# Altium project STM32 design number 2.PrjPcb
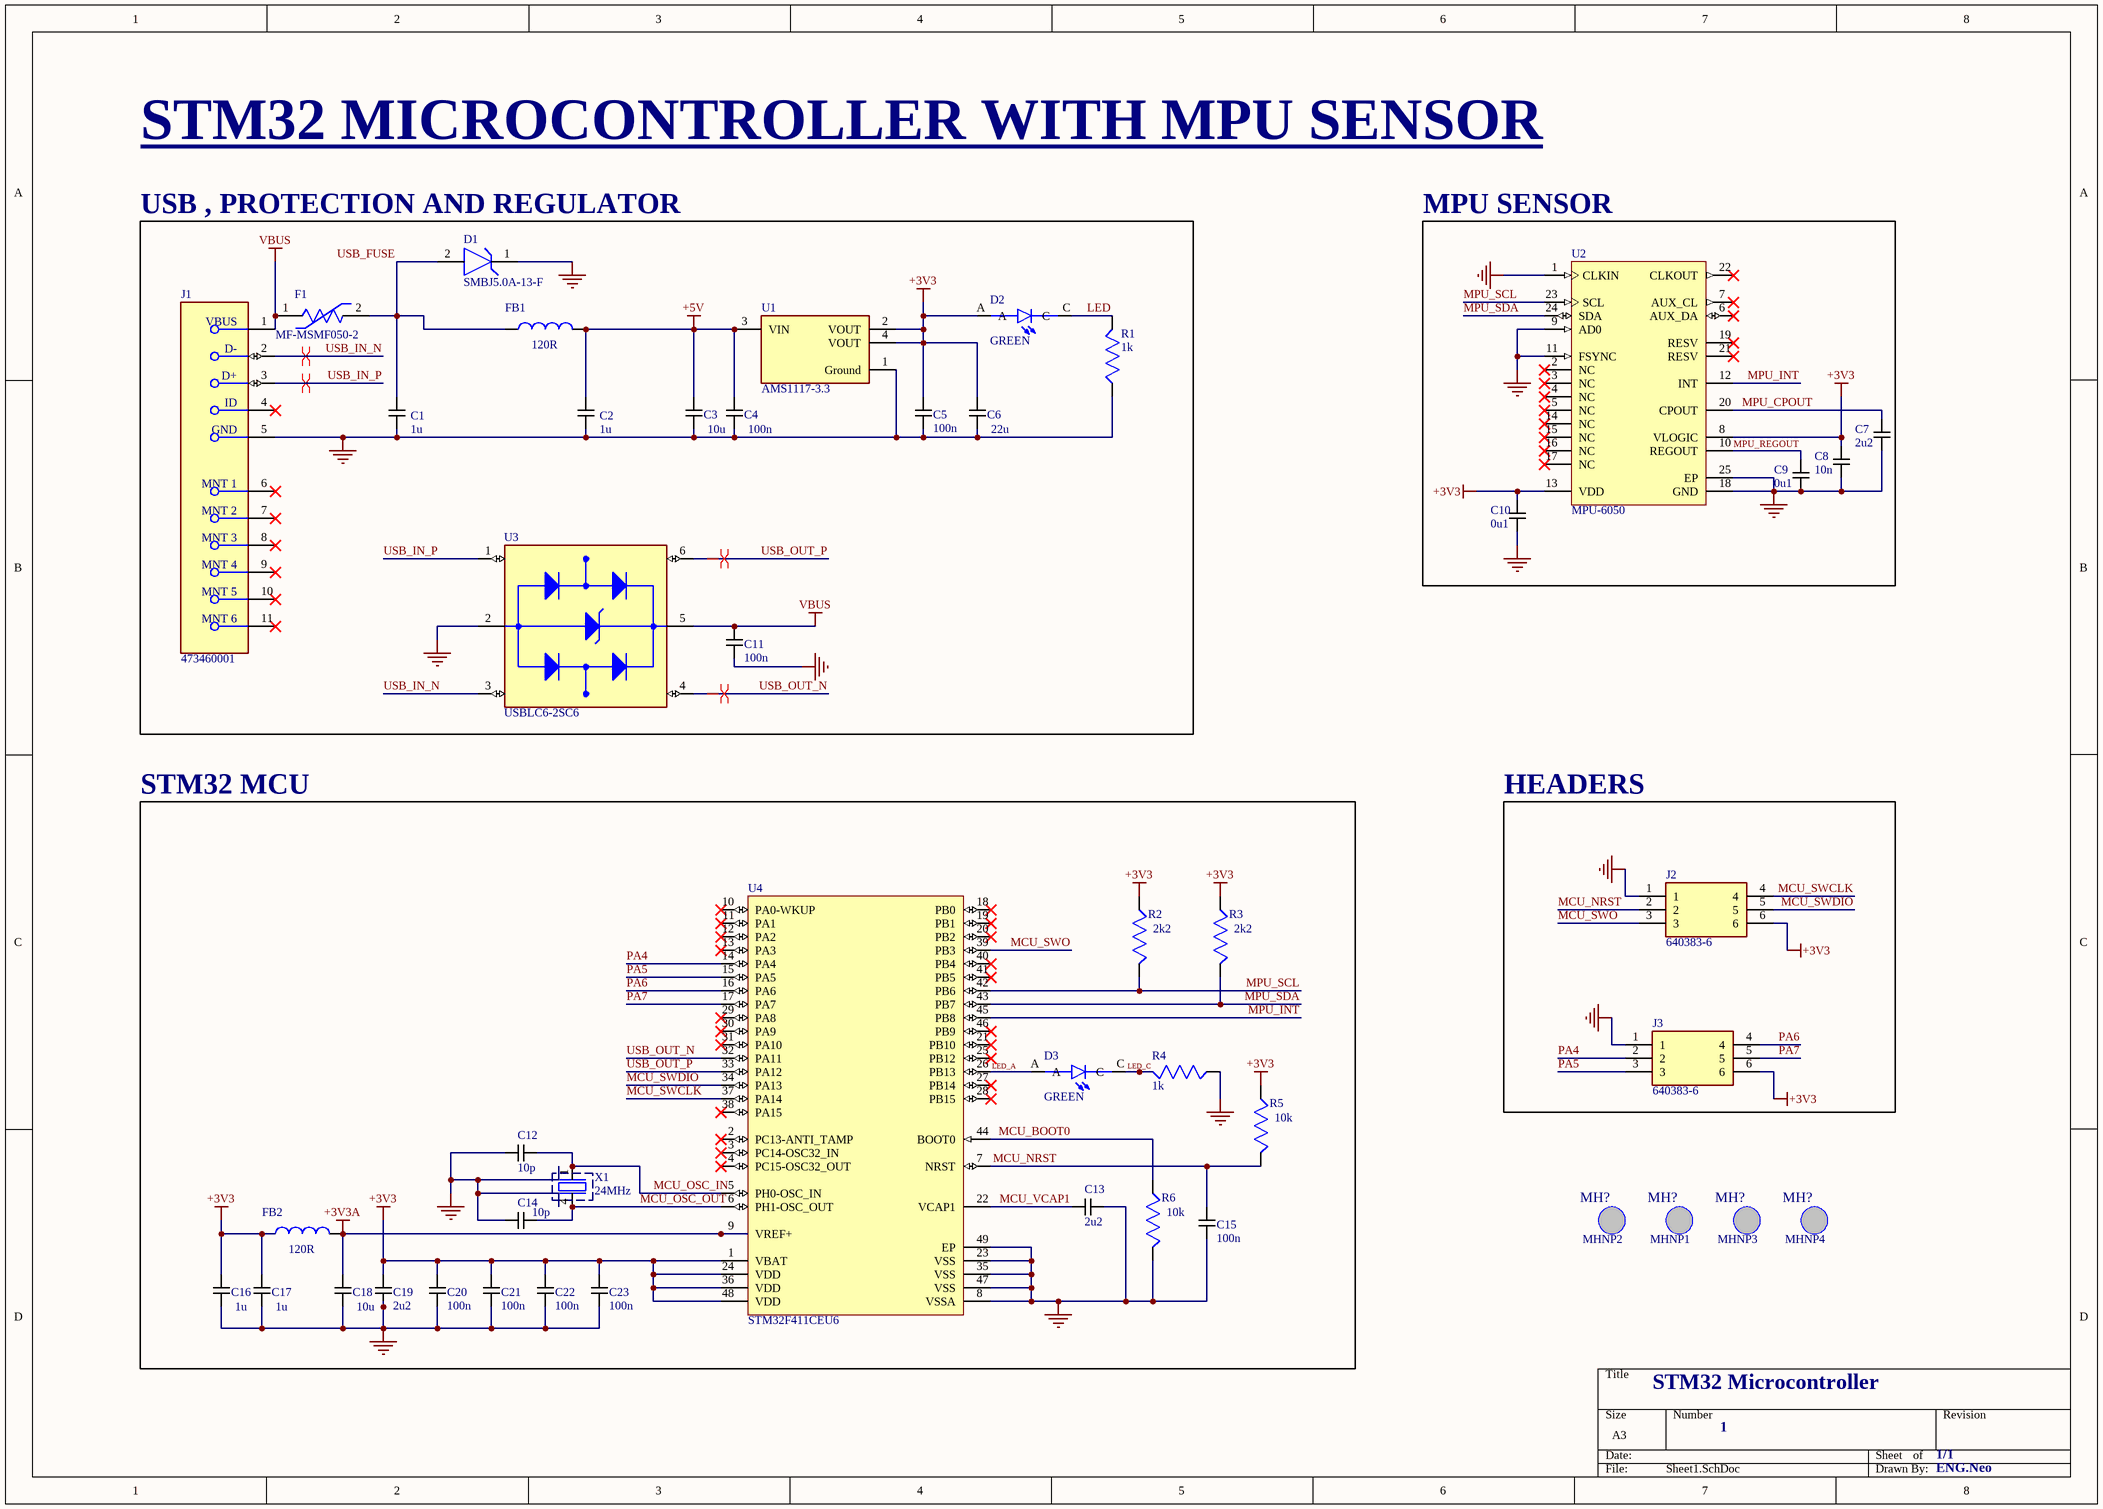
[diagram p0: Sheet1.SchDoc]
Categotry: MID; Date: Sep 21 2026; Designer: ENG.Neo; Design number: Two; Title: STM32 Microcontroller
1 sheet, 47 parts. Net scope: global (net labels, ports and power ports of the same name join across sheets).
Board file: PCB1.PcbDoc

## Sheet Sheet1.SchDoc: STM32 Microcontroller
size A3; SheetNumber: 1; SheetTotal: 1

### Parts
C1  Capacitance: 1u  [CAPCP2012X09N]  (hidden comment: 100nF Ceramic Multilayer Capacitor_1)
C2  Capacitance: 1u  [CAPCP2012X09N]  (hidden comment: 100nF Ceramic Multilayer Capacitor_1)
C3  Capacitance: 10u  [CAPCP2012X09N]  (hidden comment: 100nF Ceramic Multilayer Capacitor_1)
C4  Capacitance: 100n  [CAPCP2012X09N]  (hidden comment: 100nF Ceramic Multilayer Capacitor_1)
C5  Capacitance: 100n  [CAPCP2012X09N]  (hidden comment: 100nF Ceramic Multilayer Capacitor_1)
C6  Capacitance: 22u  [CAPCP2012X09N]  (hidden comment: 100nF Ceramic Multilayer Capacitor_1)
C7  Capacitance: 2u2  [CAPCP2012X09N]  (hidden comment: 100nF Ceramic Multilayer Capacitor_1)
C8  Capacitance: 10n  [CAPCP2012X09N]  (hidden comment: 100nF Ceramic Multilayer Capacitor_1)
C9  Capacitance: 0u1  [CAPCP2012X09N]  (hidden comment: 100nF Ceramic Multilayer Capacitor_1)
C10  Capacitance: 0u1  [CAPCP2012X09N]  (hidden comment: 100nF Ceramic Multilayer Capacitor_1)
C11  Capacitance: 100n  [CAPCP2012X09N]  (hidden comment: 100nF Ceramic Multilayer Capacitor_1)
C12  Capacitance: 10p  [CAPCP2012X09N]  (hidden comment: 100nF Ceramic Multilayer Capacitor_1)
C13  Capacitance: 2u2  [CAPCP2012X09N]  (hidden comment: 100nF Ceramic Multilayer Capacitor_1)
C14  Capacitance: 10p  [CAPCP2012X09N]  (hidden comment: 100nF Ceramic Multilayer Capacitor_1)
C15  Capacitance: 100n  [CAPCP2012X09N]  (hidden comment: 100nF Ceramic Multilayer Capacitor_1)
C16  Capacitance: 1u  [CAPCP2012X09N]  (hidden comment: 100nF Ceramic Multilayer Capacitor_1)
C17  Capacitance: 1u  [CAPCP2012X09N]  (hidden comment: 100nF Ceramic Multilayer Capacitor_1)
C18  Capacitance: 10u  [CAPCP2012X09N]  (hidden comment: 100nF Ceramic Multilayer Capacitor_1)
C19  Capacitance: 2u2  [CAPCP2012X09N]  (hidden comment: 100nF Ceramic Multilayer Capacitor_1)
C20  Capacitance: 100n  [CAPCP2012X09N]  (hidden comment: 100nF Ceramic Multilayer Capacitor_1)
C21  Capacitance: 100n  [CAPCP2012X09N]  (hidden comment: 100nF Ceramic Multilayer Capacitor_1)
C22  Capacitance: 100n  [CAPCP2012X09N]  (hidden comment: 100nF Ceramic Multilayer Capacitor_1)
C23  Capacitance: 100n  [CAPCP2012X09N]  (hidden comment: 100nF Ceramic Multilayer Capacitor_1)
D1  SMBJ5.0A-13-F  [FP-SMB-MFG]
D2  GREEN  [LEDC2012X70N]
D3  GREEN  [LEDC2012X70N]
F1  MF-MSMF050-2  [FP-MF-MSMF050-2-MFG]
FB1  120R  [WE-CBF HF_0603_HC]
FB2  120R  [WE-CBF HF_0603_HC]
J1  473460001  [FP-473460001-MFG]
J2  640383-6  [TE_640383-6]
J3  640383-6  [TE_640383-6]
MHNP1  Mounting hole non plated 3.2mm  [MHNP3P2MM]  (value not drawn)
MHNP2  Mounting hole non plated 3.2mm  [MHNP3P2MM]  (value not drawn)
MHNP3  Mounting hole non plated 3.2mm  [MHNP3P2MM]  (value not drawn)
MHNP4  Mounting hole non plated 3.2mm  [MHNP3P2MM]  (value not drawn)
R1  1k  [RESC2012X60N]
R2  2k2  [RESC2012X60N]
R3  2k2  [RESC2012X60N]
R4  1k  [RESC2012X60N]
R5  10k  [RESC2012X60N]
R6  10k  [RESC2012X60N]
U1  AMS1117-3.3  [FP-AMS1117-IPC_C]
U2  MPU-6050  [IS-QFN-24_V]
U3  USBLC6-2SC6  [SOT95P280X145-6N]
U4  STM32F411CEU6  [STM-UFQFPN48_L]
X1  value 24MHz  [Aker S5C Crystal]  (hidden comment: Aker 16MHz Crystal SMT)

### Blocks framed on the sheet
USB , PROTECTION AND REGULATOR: C1-C6 C11 D1 D2 F1 FB1 J1 R1 U1 U3
MPU SENSOR: C7-C10 U2
STM32 MCU: C12-C23 D3 FB2 R2-R6 U4 X1
HEADERS: J2 J3

### Nets
+3V3: C5.1 C6.2 C8.2 C10.2 C16.2 C17.2 C19.2 C20.2 C21.2 C22.2 C23.2 D2.A FB2.1 J2.6 J3.6 R2.2 R3.2 R5.2 U1.2(VOUT) U1.4(VOUT) U2.8(VLOGIC) U2.13(VDD) U4.1(VBAT) U4.24(VDD) U4.36(VDD) U4.48(VDD)
+3V3A: C18.2 FB2.2 U4.9(VREF+)
+5V: C2.2 C3.2 C4.2 FB1.2 U1.3(VIN)
GND: C1.1 C2.1 C3.1 C4.1 C5.2 C6.1 C7.1 C8.1 C9.1 C10.1 C11.2 C12.2 C13.1 C14.2 C15.1 C16.1 C17.1 C18.1 C19.1 C20.1 C21.1 C22.1 C23.1 D1.1(C) J1.5(GND) J2.1 J3.1 R1.2 R4.2 R6.1 U1.1(Ground) U2.1(CLKIN) U2.9(AD0) U2.11(FSYNC) U2.18(GND) U2.25(EP) U3.2(GND) U4.8(VSSA) U4.23(VSS) U4.35(VSS) U4.47(VSS) U4.49(EP) X1.2(Gnd) X1.3(Gnd)
VBUS: C11.1 F1.1 J1.1(VBUS) U3.5(VBUS)
LED: D2.C R1.1
LED_A: D3.A U4.26(PB13)
LED_C: D3.C R4.1
MCU_BOOT0: R6.2 U4.44(BOOT0)
MCU_NRST: C15.2 J2.2 R5.1 U4.7(NRST)
MCU_OSC_IN: C12.1 U4.5(PH0-OSC_IN) X1.1
MCU_OSC_OUT: C14.1 U4.6(PH1-OSC_OUT) X1.4
MCU_SWCLK: J2.4 U4.37(PA14)
MCU_SWDIO: J2.5 U4.34(PA13)
MCU_SWO: J2.3 U4.39(PB3)
MCU_VCAP1: C13.2 U4.22(VCAP1)
MPU_CPOUT: C7.2 U2.20(CPOUT)
MPU_INT: U2.12(INT) U4.45(PB8)
MPU_REGOUT: C9.2 U2.10(REGOUT)
MPU_SCL: R2.1 U2.23(SCL) U4.42(PB6)
MPU_SDA: R3.1 U2.24(SDA) U4.43(PB7)
PA4: J3.2 U4.14(PA4)
PA5: J3.3 U4.15(PA5)
PA6: J3.4 U4.16(PA6)
PA7: J3.5 U4.17(PA7)
USB_FUSE: C1.2 D1.2(A) F1.2 FB1.1
USB_IN_N: J1.2(D-) U3.3(I/O2_IN)
USB_IN_P: J1.3(D+) U3.1(I/O1_IN)
USB_OUT_N: U3.4(I/O2_OUT) U4.32(PA11)
USB_OUT_P: U3.6(I/O1_OUT) U4.33(PA12)

Not connected (* = marked no-connect by the designer): J1 4(ID)* 6(MNT_1)* 7(MNT_2)* 8(MNT_3)* 9(MNT_4)* 10(MNT_5)* 11(MNT_6)*; U2 2(NC)* 3(NC)* 4(NC)* 5(NC)* 6(AUX_DA)* 7(AUX_CL)* 14(NC)* 15(NC)* 16(NC)* 17(NC)* 19(RESV)* 21(RESV)* 22(CLKOUT)*; U4 2(PC13-ANTI_TAMP)* 3(PC14-OSC32_IN)* 4(PC15-OSC32_OUT)* 10(PA0-WKUP)* 11(PA1)* 12(PA2)* 13(PA3)* 18(PB0)* 19(PB1)* 20(PB2)* 21(PB10)* 25(PB12)* 27(PB14)* 28(PB15)* 29(PA8)* 30(PA9)* 31(PA10)* 38(PA15)* 40(PB4)* 41(PB5)* 46(PB9)*

### Layout directives
differential pair; differential pair class DIFF_USB_IN: USB_IN_N, USB_IN_P, USB_OUT_N, USB_OUT_P

### Notes on the sheet
- STM32 MICROCONTROLLER WITH MPU SENSOR
- 1
- 1/1
- (in symbol MHNP3P2MM) MH?

### Library data of the parts
C1-C23 = 100nF Ceramic Multilayer Capacitor_1: AVX 0805 Standard 100nF Ceramic Multilayer Capacitor, 50 V dc X7R Dielectric ±10% SMD; Voltage: 50V; Creator: Ritesh Kanjee; Date Created: 18 February 2015; Package: 0805; Manufacturer: AVX; RS Stock No.: 464-6688; Datasheet URL: http://za.rs-online.com/web/p/ceramic-multilayer-capacitors/4646688/
D1 = CMP-12828-000017-1: TVS DIODE 5V 9.2V SMB; Manufacturer: Diodes Inc; Number Of Channels: 1; Peak Pulse Current: 65.2A; Max Junction Temp: +150°C; Standoff Height: 0.05mm; Peak Pulse Power: 600W; Direction: Unidirectional; Breakdown Voltage: 6.4V; Temperature: -55°C to +150°C; Package: SMB; Automotive: No; Footprint Url: https://www.diodes.com/assets/Package-Files/SMB.pdf; Octopart: https://octopart.com/smbj5.0a-13-f-diodes+inc.-350946; Digikey Description: TVS DIODE 5V 9.2V SMB; Clamping Voltage: 9.2V; Reverse Standoff Voltage: 5V; Device Class L2: TVS Diodes; RoHS: TRUE; Device Class L1: Circuit Protection; ComponentLink2URL: https://www.diodes.com/assets/Datasheets/ds19002.pdf; Mouser Description: TVS Diodes - Transient Voltage Suppressors 600W 5.0V; Lead Free: Yes; Device Class L3: unset; Temperature Range High: +150°C; Temperature Range Low: -55°C; Category: Diode; ComponentLink2Description: Datasheet; Manufacturer Part Number: SMBJ5.0A-13-F; Height: 2.5mm
D2 D3 = 597-3305-607F: LED Uni-Color Green 4-Pin Chip 0805 T/R; Availability: Unavailable; Value: *; Price: None; MP: 597-3305-607F; Package: None
F1 = CMP-2100-03653-2: PTC RESET FUSE 15V 500MA 1812; Manufacturer: Bourns; Value: 0.15-1Ω; Trip Current: 1A; Automotive Grade: Grade 3; Trip Time: 0.15s; Current Rating: 100A; Hold Current: 0.5A; Height: 0.85mm; Package: 1812; Voltage Rating: 15V; Temperature Range High: +85°C; Device Class L2: PTC Resettable Fuses; Lead Free: Yes; ComponentLink2URL: http://www.bourns.com/docs/Product-Datasheets/mfmsmf.pdf; Ambient Temperature Range High: +85°C; Mouser Description: PTC Resettable Fuse 0.5A(hold) 1A(trip) 15V 100A 0.8W 0.15s 0.15Ohm SMD Solder Pad 1812 T/R; Digikey Description: PTC RESET FUSE 15V 500MA 1812; Manufacturer Part Number: MF-MSMF050-2; Resistance: 0.15-1Ω; Category: Fuse; ComponentLink2Description: Datasheet; Automotive: Yes; Temperature Range Low: -40°C; RoHS: TRUE; Device Class L1: Circuit Protection; Temperature: -40°C to +85°C; Octopart: https://octopart.com/mf-msmf050-2-bourns-28047; Ambient Temperature Range Low: -40°C; Device Class L3: unset
FB1 FB2 = CMP-0220-00101-3: Ferrite Bead (emi Suppression), 1.6X0.8X0.8MM (0603), 600O Impedance At 100 Mhz; Current Rating: 400mA; DC Resistance (DCR): 220mΩ; Max Current Rating: 500mA; Impedance: 600Ω; Tolerance: 25%; Resistance: 350mΩ; Number of Lines: 1; Test Frequency: 100MHz; Height: 800µm; Min Operating Temperature: -55°C; Length: 1.6mm; Width: 800µm; Case Code (Imperial): 0603; Depth: 800µm; Number of Pins: 2; Case Code (Metric): 1608; Case/Package: SMD/SMT; Lead Free: Lead Free; Core Material: Ferrite; Max Operating Temperature: 125°C; Termination: SMD/SMT; RoHS: Compliant; REACH SVHC: Unknown; Max DC Current: 500mA; Mount: Surface Mount
J1 = CMP-2000-05246-2: CONN RCPT USB2.0 MICRO B SMD R/A; Manufacturer: Molex; Conn Orientation: Right Angle; Is Female: yes; Shielding: true; Pitch: 0.65mm; Number Of Contacts: 5; Voltage Rating: 30V; Current Rating: 1.8A; Device Class L2: USB Connectors; Digikey Description: CONN RCPT USB2.0 MICRO B SMD R/A; Height: 2.945mm; RoHS: TRUE; ComponentLink2Description: Datasheet; Octopart: https://octopart.com/47346-0001-molex-7164928; Automotive: No; Package: 0; Category: Conn; Device Class L1: Connectors; Usb Standard: USB 2.0; Temperature: -30°C to +85°C; Temperature Range Low: -30°C; Footprint Url: https://www.molex.com/pdm_docs/sd/473460001_sd.pdf; ComponentLink2URL: https://www.molex.com/webdocs/datasheets/pdf/en-us/0473460001_IO_CONNECTORS.pdf; Lead Free: Yes; Manufacturer Part Number: 473460001; Contact Material: Gold,Nickel; Temperature Range High: +85°C; Device Class L3: unset
J2 J3 = 640383-6: Header, Conn,Interconnect System,PCB Plug,6 Cont,Solder,MTA-156 Series,Straight | TE Connectivity 640383-6; SnapEDA_Link: https://www.snapeda.com/parts/640383-6/TE+Connectivity+AMP+Connectors/view-part/?ref=snap; Package: None; Value: *; MF: TE Connectivity; MP: 640383-6; EU_RoHS_Compliance: Compliant; Check_prices: https://www.snapeda.com/parts/640383-6/TE+Connectivity+AMP+Connectors/view-part/?ref=eda
MHNP1-MHNP4 = MHNP3P2MM: Mounting hole non plated 3.2mm drill hole
R1-R6 = RC0805FR-102K7L: Availability: Unavailable; MP: RC0805FR-102K7L; Price: None; Value: *; Package: None
U1 = CMP-209535-000001-1: LDO Voltage Regulators 1A, 3.3V; Manufacturer: Advanced Monolithic Systems; Dropout Voltage: 1.1V; Output Type: Fixed; Nominal Supply Current: 5mA; Max Power Dissipation: 1.2W; Max Supply Voltage: 15V; Number Of Outputs: 1; Standoff Height: 0.64mm; Max Junction Temp: +125°C; Height: 1.8mm; Package: AMS1117; Device Class L2: Power Management ICs; ComponentLink2Description: Datasheet; ComponentLink2URL: http://www.advanced-monolithic.com/pdf/ds1117.pdf; Category: IC; RoHS: TRUE; Automotive: No; Device Class L1: Integrated Circuits (ICs); Output Current: 1A; Device Class L3: Voltage Regulators - Linear; Temperature: -40°C to +125°C; Output Voltage: 3.3V; Manufacturer Part Number: AMS1117-3.3; Temperature Range Low: -40°C; Octopart: https://octopart.com/ams1117-3.3-advanced+monolithic+systems-25899300; Lead Free: Yes; Ipc Land Pattern Name: SOT229P700X180-4; Temperature Range High: +125°C
U2 = CMP-1753-00002-2: 3-Axis Gyroscope, Accelerometer and a Digital Motion Processor(TM) (DMP), 2.375 to 3.46 V, -40 to 85 degC, 24-Pin QFN, RoHS, Tape and Reel; Manufacturer: InvenSense; Featured Product: MPU-60506-Axis,IntegratedI²CSolution; Other Names: 1428-1007-2 / MPU6050; Sensor Type: MotionTracking; Online Catalog: MPU-6000™Series; Unit PriceUSD: Digital; Datasheet Version: Rev. 3.3, 05/2012; Category: Sensors,Transducers; Datasheet URL: http://datasheet.octopart.com/MPU-6050-InvenSense-datasheet-14421344.pdf; Family: Multifunction; Standard Package: 5,000; Manufacturer URL: http://www.invensense.com/; Output Type: Digital; Dynamic Catalog: MPU-6000™Series
U3 = USBLC6-2SC6: 17V Clamp 5A (8/20Âµs) Ipp Tvs Diode Surface Mount SOT-23-6; MF: STMicroelectronics; Value: *; SnapEDA_Link: https://www.snapeda.com/parts/USBLC6-2SC6/STMicroelectronics/view-part/?ref=snap; Check_prices: https://www.snapeda.com/parts/USBLC6-2SC6/STMicroelectronics/view-part/?ref=eda; Purchase-URL: https://pricing.snapeda.com/search/part/USBLC6-2SC6/?ref=eda; Price: None; Availability: In Stock; Package: SOT-23-6 STMicroelectronics; MP: USBLC6-2SC6
U4 = CMP-0243-00165-1: ARM Cortex-M4 32-bit MCU+FPU, 512 KB Flash, 128 KB RAM, 36 I/Os, 48-Pin UFQFPN, -40 to 85 degC, Tray; Operating Frequency(F) (Processor speed) (MHz): 100; FLASH Size (Prog) (kB): 512; Internal RAM Size (kB): 128; I/Os (High Current): 36; Supply Voltage(Vcc) min (V): 1.7; Package Reference: 48-Pin Ultra Thin Fine Pitch Quad Flat No-Lead, 7 x 7 x 0.6 mm Body, 0.5 mm Pitch, Exposed Pad; ComponentLink1Description: Manufacturer URL; ComponentLink1URL: http://www.st.com/; Packing: Tray; Package Description: UFQFPN48; Core: ARM Cortex-M4; ComponentLink2Description: Datasheet; ComponentLink2URL: http://www.st.com/st-web-ui/static/active/en/resource/technical/document/datasheet/DM00115249.pdf; DatasheetVersion: Rev. 6; Mounting Technology: Surface Mount
X1 = Aker  C5S-16.000-12-3030-X: Aker S5C SMT Crystal; Load Capacitance: 12pF; Frequency Stability: +/-30ppm; RS: RS 671-9488; Creator: R Kanjee; Manufacturer: Aker; Manufacturer Part #: C5S-16.000-12-3030-X; Supplier: RS; RS Stock Nr.: 671-9488; HelpURL: http://za.rs-online.com/web/p/crystal-units/6719488/; Package: 3.2x5mm SMD